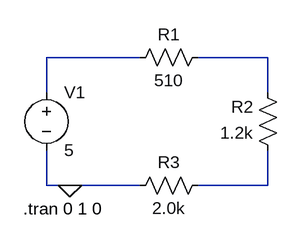
[diagram p0: schematic ScematicSeries.asc]
ScematicSeries.asc, the LTspice schematic file:
Version 4
SHEET 1 880 680
WIRE 160 80 32 80
WIRE 336 80 240 80
WIRE 32 128 32 80
WIRE 336 128 336 80
WIRE 32 256 32 208
WIRE 64 256 32 256
WIRE 160 256 64 256
WIRE 336 256 336 208
WIRE 336 256 240 256
FLAG 64 256 0
SYMBOL voltage 32 112 R0
WINDOW 123 0 0 Left 0
WINDOW 39 0 0 Left 0
SYMATTR InstName V1
SYMATTR Value 5
SYMBOL res 256 64 R90
WINDOW 0 0 56 VBottom 2
WINDOW 3 32 56 VTop 2
SYMATTR InstName R1
SYMATTR Value 510
SYMBOL res 352 224 R180
WINDOW 0 36 76 Left 2
WINDOW 3 36 40 Left 2
SYMATTR InstName R2
SYMATTR Value 1.2k
SYMBOL res 144 272 R270
WINDOW 0 32 56 VTop 2
WINDOW 3 0 56 VBottom 2
SYMATTR InstName R3
SYMATTR Value 2.0k
TEXT 0 288 Left 2 !.tran 0 1 0

The netlist it stands for:
* ScematicSeries.asc
V1 N001 0 5
R1 N002 N001 510
R2 N003 N002 1.2k
R3 0 N003 2.0k
.tran 0 1 0
.backanno
.end